# EAGLE design Inv ctl rev3 (EAGLE 7.5.0)
Connections for LCD, moved Vin to A7
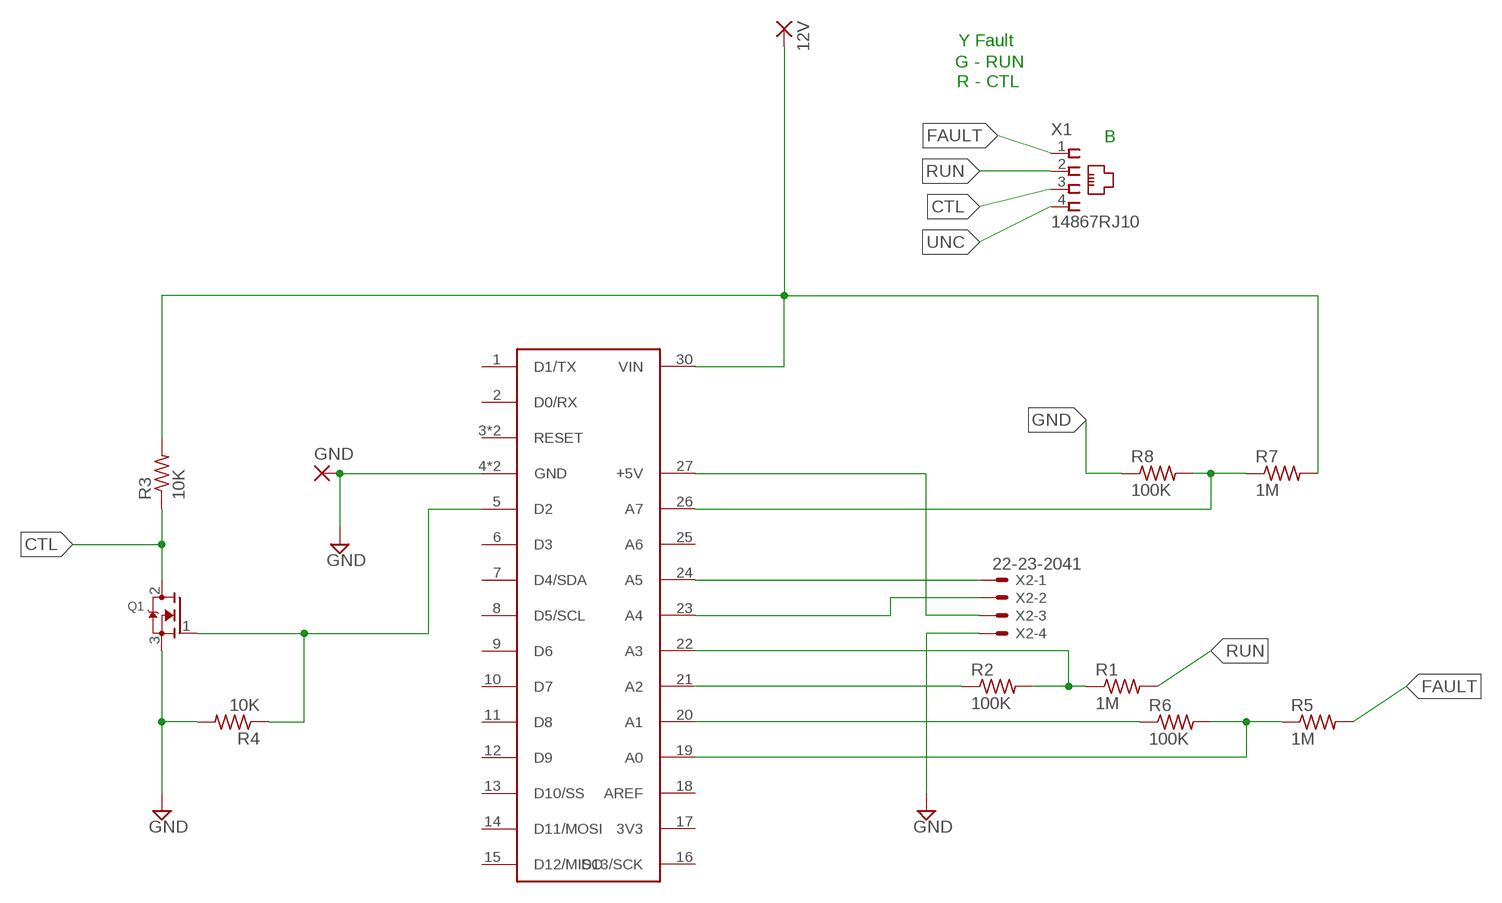
[diagram p0: schematic, sheet 1]

## Parts
12V  3,81/1,4  [3,81/1,4]
GND  3,81/1,4  [3,81/1,4]
Q1  MOSFET-N  [TO252]
R1  1M  R-US_R1206  [R1206]
R2  100K  R-US_R1206  [R1206]
R3  10K  R-US_R0805  [R0805]
R4  10K  R-US_R0805  [R0805]
R5  1M  R-US_R1206  [R1206]
R6  100K  R-US_R1206  [R1206]
R7  1M  R-US_R1206  [R1206]
R8  100K  R-US_R1206  [R1206]
U$1  ARDUINO_NANO  [ARDUINO_NANO]
X1  14867RJ10  [RJ10]
X2  22-23-2041  [22-23-2041]

## Nets
12V: 12V.1(P) R3.2 R7.2 U$1.30(VIN)
CTL: Q1.2(D) R3.1 X1.3
FAULT: R5.2 X1.1
GND: GND.1(P) Q1.3(S) R4.2 R8.1 U$1.4(GND) U$1.29(GND) X2.4
LINEVOLTAGE: R7.1 R8.2 U$1.26(A7)
N$6: Q1.1(G) R4.1 U$1.5(D2)
N$7: U$1.27(+5V) X2.3
N$11: R2.1 U$1.21(A2)
N$12: R6.1 U$1.20(A1)
N$13: R5.1 R6.2 U$1.19(A0)
RUN: R1.2 X1.2
RUNMODE: R1.1 R2.2 U$1.22(A3)
SCL: U$1.24(A5) X2.1
SDA: U$1.23(A4) X2.2
UNC: X1.4
Unconnected: U$1.1(D1/TX) U$1.2(D0/RX) U$1.3(RESET) U$1.6(D3) U$1.7(D4/SDA) U$1.8(D5/SCL) U$1.9(D6) U$1.10(D7) U$1.11(D8) U$1.12(D9) U$1.13(D10/SS) U$1.14(D11/MOSI) U$1.15(D12/MISO) U$1.16(D13/SCK) U$1.17(3V3) U$1.18(AREF) U$1.25(A6) U$1.28(RESET)

## Notes on the sheet
- Y Fault
- G - RUN
- R - CTL
- B

## Library data of the parts
12V GND = wirepad:3,81/1,4: THROUGH-HOLE PAD
Q1 = tsimon:MOSFET-N: N-Channel Mosfet 2N7002E - 60V 260mA SOT23 [Digikey: 2N7002ET1GOSTR-ND] - REEL BSH103 - 30V 850mA SOT23 [Digikey: 568-5013-1-ND]
R1-R8 = resistor:R-US_: RESISTOR, American symbol
U$1 = Arduino_Nano2:ARDUINO_NANO
X1 = con-4ucon:14867: RJ11 Connector Source: 4UCON TECHNOLOGY INC. 14867.pdf
X2 = con-molex:22-23-2041: .100" (2.54mm) Center Header - 4 Pin; MF: MOLEX; MPN: 22-23-2041; OC_FARNELL: 1462920; OC_NEWARK: 38C0355

## Board
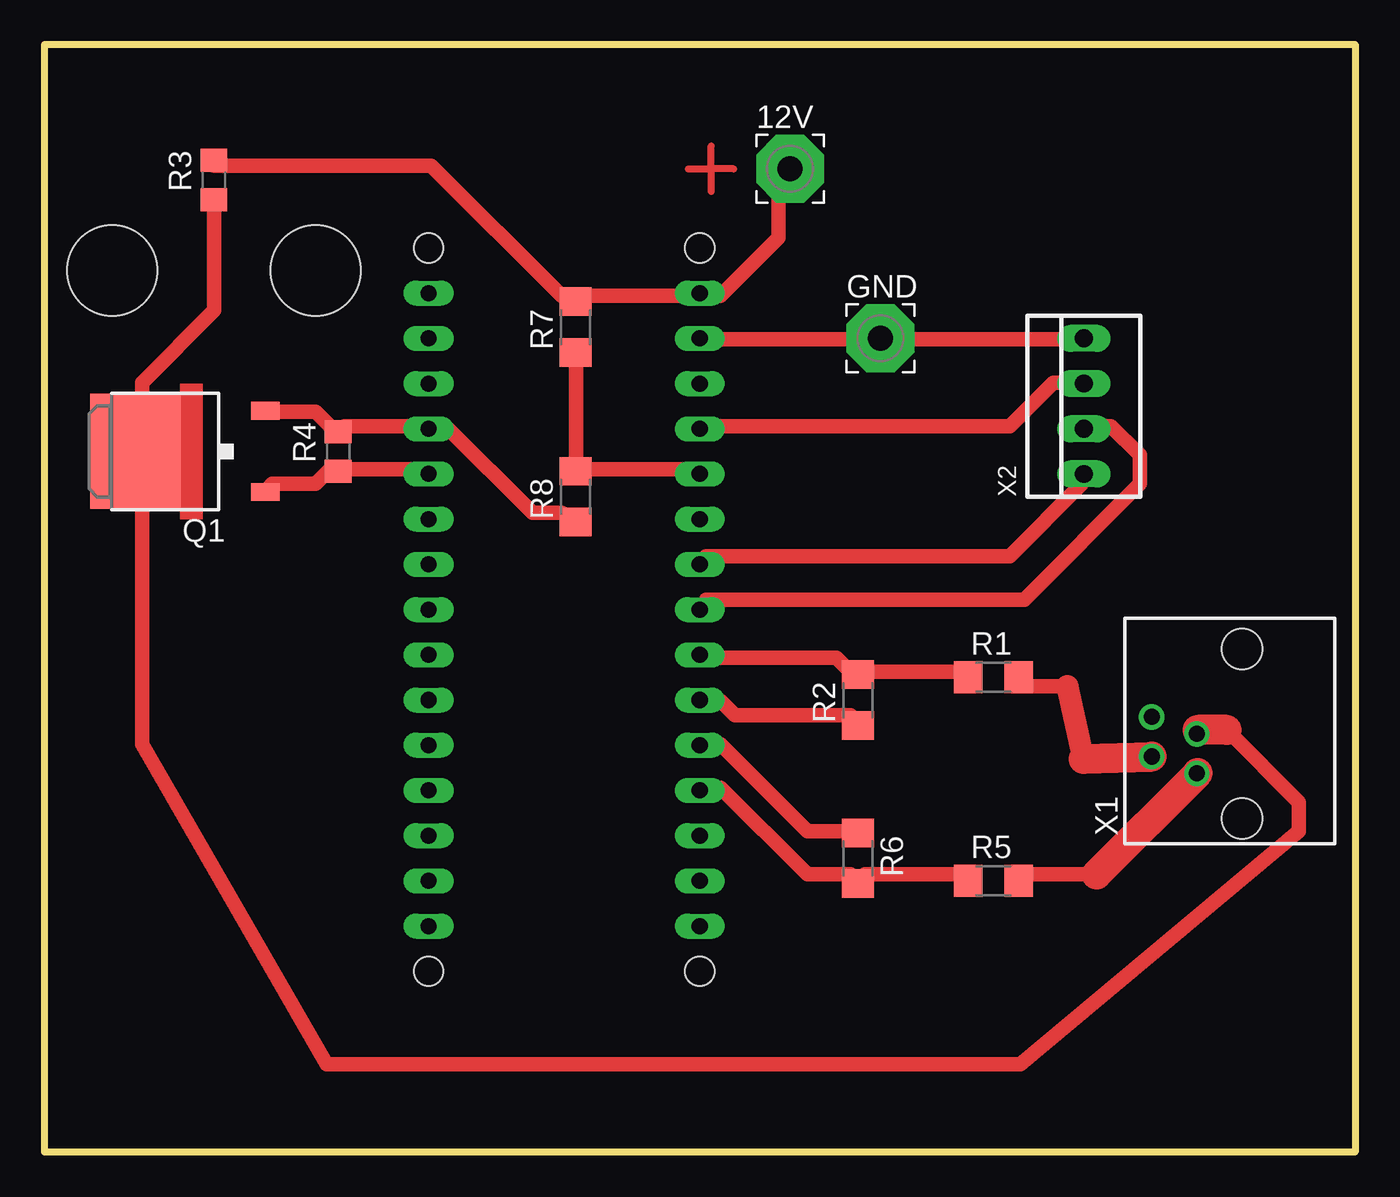
[diagram p1: board, top side]
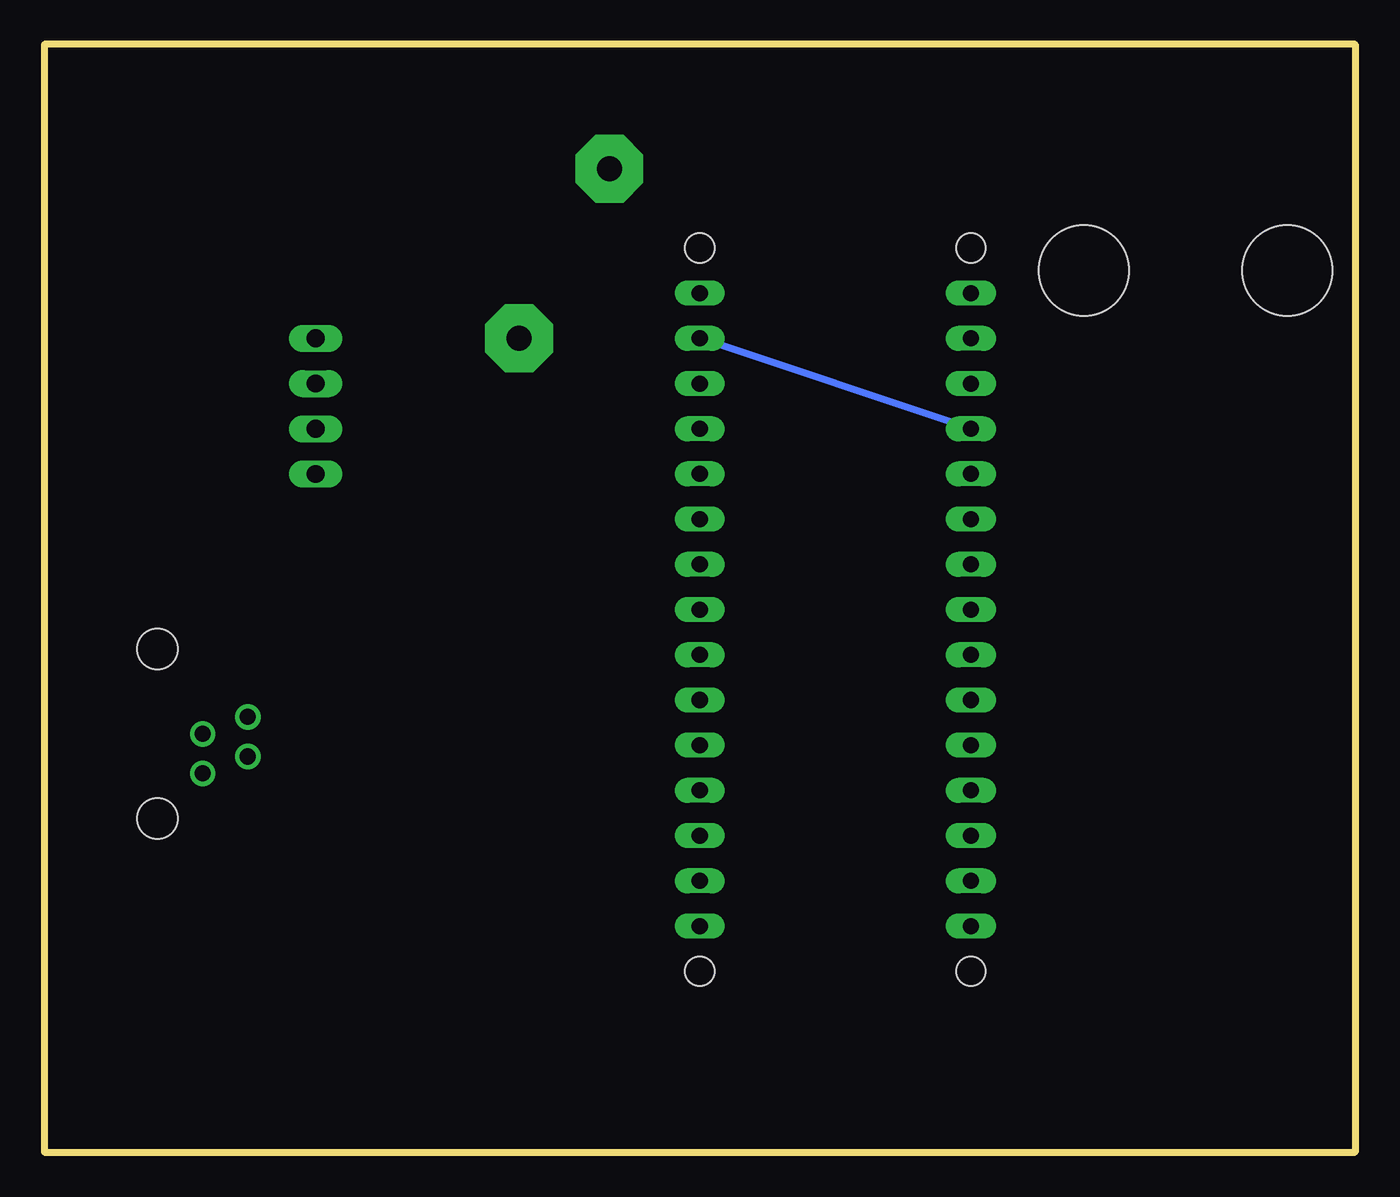
[diagram p2: board, bottom side, seen from below]

Size 73.66 x 62.23 mm. Coordinates in mm from the lower left corner, seen from the top.
Outline: 73.66,0 0,0 0,62.23 73.66,62.23 73.66,0
Copper layers (1*16): Top 0.035mm / dielectric 1.5mm / Bottom 0.035mm
Design rules "default *": minimum track width 32mil, minimum drill 32mil, track to track 32mil, track to pad 32mil, pad to pad 32mil, via to via 32mil, smd to smd 32mil, copper to edge 40mil, drill to drill 8mil, minimum pad ring 10mil, minimum via ring 8mil, stop-mask expansion 4mil, vias tented up to drill 0mil, thermal gap 10mil
Holes 5.08 mm at 3.81,49.53 15.24,49.53

### Footprints (pad centres in the part's own frame; a part is rotated, then mirrored left to right if it is on the bottom)
3,81/1,4 = drill 1.397 pad 3.81 octagon: 1 0,0
TO252 = smd 1 x 1.6: 1 -2.28,-4.8; 3 2.28,-4.8 | smd 6.452 x 5.08: 2 0,2.5
R1206 = smd 1.6 x 1.803: 1 -1.422,0; 2 1.422,0
R0805 = smd 1.3 x 1.5: 1 -1.109,0; 2 1.109,0
ARDUINO_NANO = drill 0.9 long: 1 -7.62,17.78; 2 -7.62,15.24; 3 -7.62,12.7; 4 -7.62,10.16; 5 -7.62,7.62; 6 -7.62,5.08; 7 -7.62,2.54; 8 -7.62,0; 9 -7.62,-2.54; 10 -7.62,-5.08; 11 -7.62,-7.62; 12 -7.62,-10.16; 13 -7.62,-12.7; 14 -7.62,-15.24; 15 -7.62,-17.78; 16 7.62,-17.78; 17 7.62,-15.24; 18 7.62,-12.7; 19 7.62,-10.16; 20 7.62,-7.62; 21 7.62,-5.08; 22 7.62,-2.54; 23 7.62,0; 24 7.62,2.54; 25 7.62,5.08; 26 7.62,7.62; 27 7.62,10.16; 28 7.62,12.7; 29 7.62,15.24; 30 7.62,17.78 | hole 1.651: -7.62,-20.32; 7.62,-20.32; 7.62,20.32; -7.62,20.32
RJ10 = drill 0.9 pad 1.422: 1 -1.587,6.35; 2 -0.635,8.89; 3 0.635,6.35; 4 1.587,8.89 | hole 2.286: -4.128,3.81; 5.397,3.81
22-23-2041 = drill 1 long: 1 -3.81,0; 2 -1.27,0; 3 1.27,0; 4 3.81,0

### Placement (x,y rotation side)
12V  41.91,55.24 0 top
GND  46.99,45.72 0 top
Q1  7.62,39.37 90 top
R1  53.34,26.67 0 top
R2  45.72,25.4 90 top
R3  9.53,54.61 90 top
R4  16.51,39.37 90 top
R5  53.34,15.24 0 top
R6  45.72,16.51 270 top
R7  29.84,46.35 90 top
R8  29.84,36.83 90 top
U$1  29.21,30.48 0 top
X1  71.12,22.86 90 top
X2  58.42,41.91 90 top

### Tracks (layer width: path | path; a pad name or v marks a point on that pad's centre or on a via)
12V
  Top 0.813: R3.2 9.55,55.42 21.74,55.42 29.06,48.11 R7.2 29.87,48.11 36.37,48.11 U$1.30 37.19,48.11 38,48.11 41.25,51.36 41.25,54.61 12V.1
CTL
  Top 0.813: R3.1 9.55,52.98 9.55,47.3 5.49,43.23 5.49,39.98 Q1.2 5.49,39.17 5.49,22.91 15.85,4.93 54.86,4.93 70.51,18.03 70.51,19.66 66.45,23.72 | 64.82,23.72 X1.3
  Top 1.676: 66.45,23.72 64.82,23.72
FAULT
  Top 0.813: 59.13,15.6 55.07,15.6 R5.2 | 64.82,21.29 X1.1
  Top 1.676: 64.82,21.29 59.13,15.6
GND
  Top 0.813: Q1.3 12.8,41.6 15.24,41.6 16.05,40.79 R4.2 16.87,40.79 20.93,40.79 U$1.4 21.74,40.79 22.55,40.79 27.43,35.92 29.06,35.92 R8.1 | 36.37,45.67 U$1.29 37.19,45.67 46.94,45.67 GND.1 47.75,45.67 58.32,45.67 X2.4
  Bottom 0.406: U$1.4 U$1.29
LINEVOLTAGE
  Top 0.813: 29.87,38.35 36.37,38.35 U$1.26 | 29.87,38.35 29.87,44.86 R7.1 | 29.87,38.35 R8.2
N$6
  Top 0.813: U$1.5 20.93,38.35 16.87,38.35 R4.1 16.05,38.35 15.24,37.54 12.8,37.54 Q1.1
N$7
  Top 0.813: U$1.27 37.19,40.79 54.25,40.79 56.69,43.23 58.32,43.23 X2.3
N$11
  Top 0.813: R2.1 45.31,24.54 38.81,24.54 38,25.35 37.19,25.35 U$1.21
N$12
  Top 0.813: R6.1 45.31,18.03 42.88,18.03 38,22.91 37.19,22.91 U$1.20
N$13
  Top 0.813: R5.1 51.82,15.6 46.13,15.6 R6.2 45.31,15.6 42.88,15.6 38,20.47 37.19,20.47 U$1.19
N$14
  Top 0.406: 36.2,55.24 37.47,55.24 | 38.73,55.24 37.47,55.24 | 37.47,55.24 37.47,53.98 | 37.47,55.24 37.47,56.52
RUN
  Top 0.813: 57.51,26.16 55.07,26.16 R1.2
  Top 1.27: 58.4,22.1 57.51,26.16
  Top 1.676: 58.4,22.1 X1.2
RUNMODE
  Top 0.813: R1.1 51.82,26.98 46.13,26.98 R2.2 45.31,26.98 44.5,27.79 37.19,27.79 U$1.22
SCL
  Top 0.813: U$1.24 37.19,33.48 54.25,33.48 58.32,37.54 X2.1
SDA
  Top 0.813: U$1.23 37.19,31.04 55.07,31.04 61.57,37.54 61.57,39.17 59.94,40.79 59.13,40.79 X2.2
(copper drawn outside any net)
  shapes: Top area x1